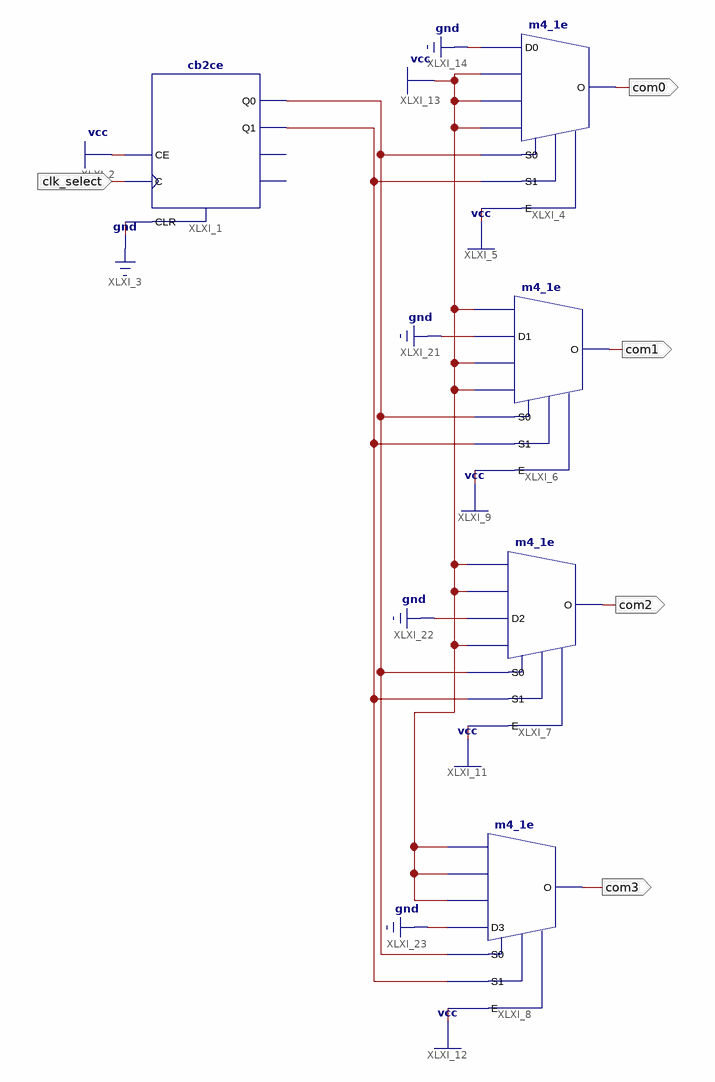
[diagram p0: schematic sheet 1]
// Xilinx ISE schematic selectCommon.sch (spartan6) as structural Verilog: 5 symbols, 5 ports
module selectCommon (
  input  clk_select,
  output com0,
  output com1,
  output com2,
  output com3
);

  wire XLXN_4, XLXN_5;

  cb2ce XLXI_1 (.C(clk_select), .CE(1'b1), .CLR(1'b0), .Q0(XLXN_4), .Q1(XLXN_5));  // open: CEO, TC
  m4_1e XLXI_4 (.D0(1'b0), .D1(1'b1), .D2(1'b1), .D3(1'b1), .E(1'b1), .S0(XLXN_4), .S1(XLXN_5), .O(com0));
  m4_1e XLXI_7 (.D0(1'b1), .D1(1'b1), .D2(1'b0), .D3(1'b1), .E(1'b1), .S0(XLXN_4), .S1(XLXN_5), .O(com2));
  m4_1e XLXI_8 (.D0(1'b1), .D1(1'b1), .D2(1'b1), .D3(1'b0), .E(1'b1), .S0(XLXN_4), .S1(XLXN_5), .O(com3));
  m4_1e XLXI_6 (.D0(1'b1), .D1(1'b0), .D2(1'b1), .D3(1'b1), .E(1'b1), .S0(XLXN_4), .S1(XLXN_5), .O(com1));
endmodule
